# EAGLE design ENGI301_Project-2 (EAGLE 9.5.2)
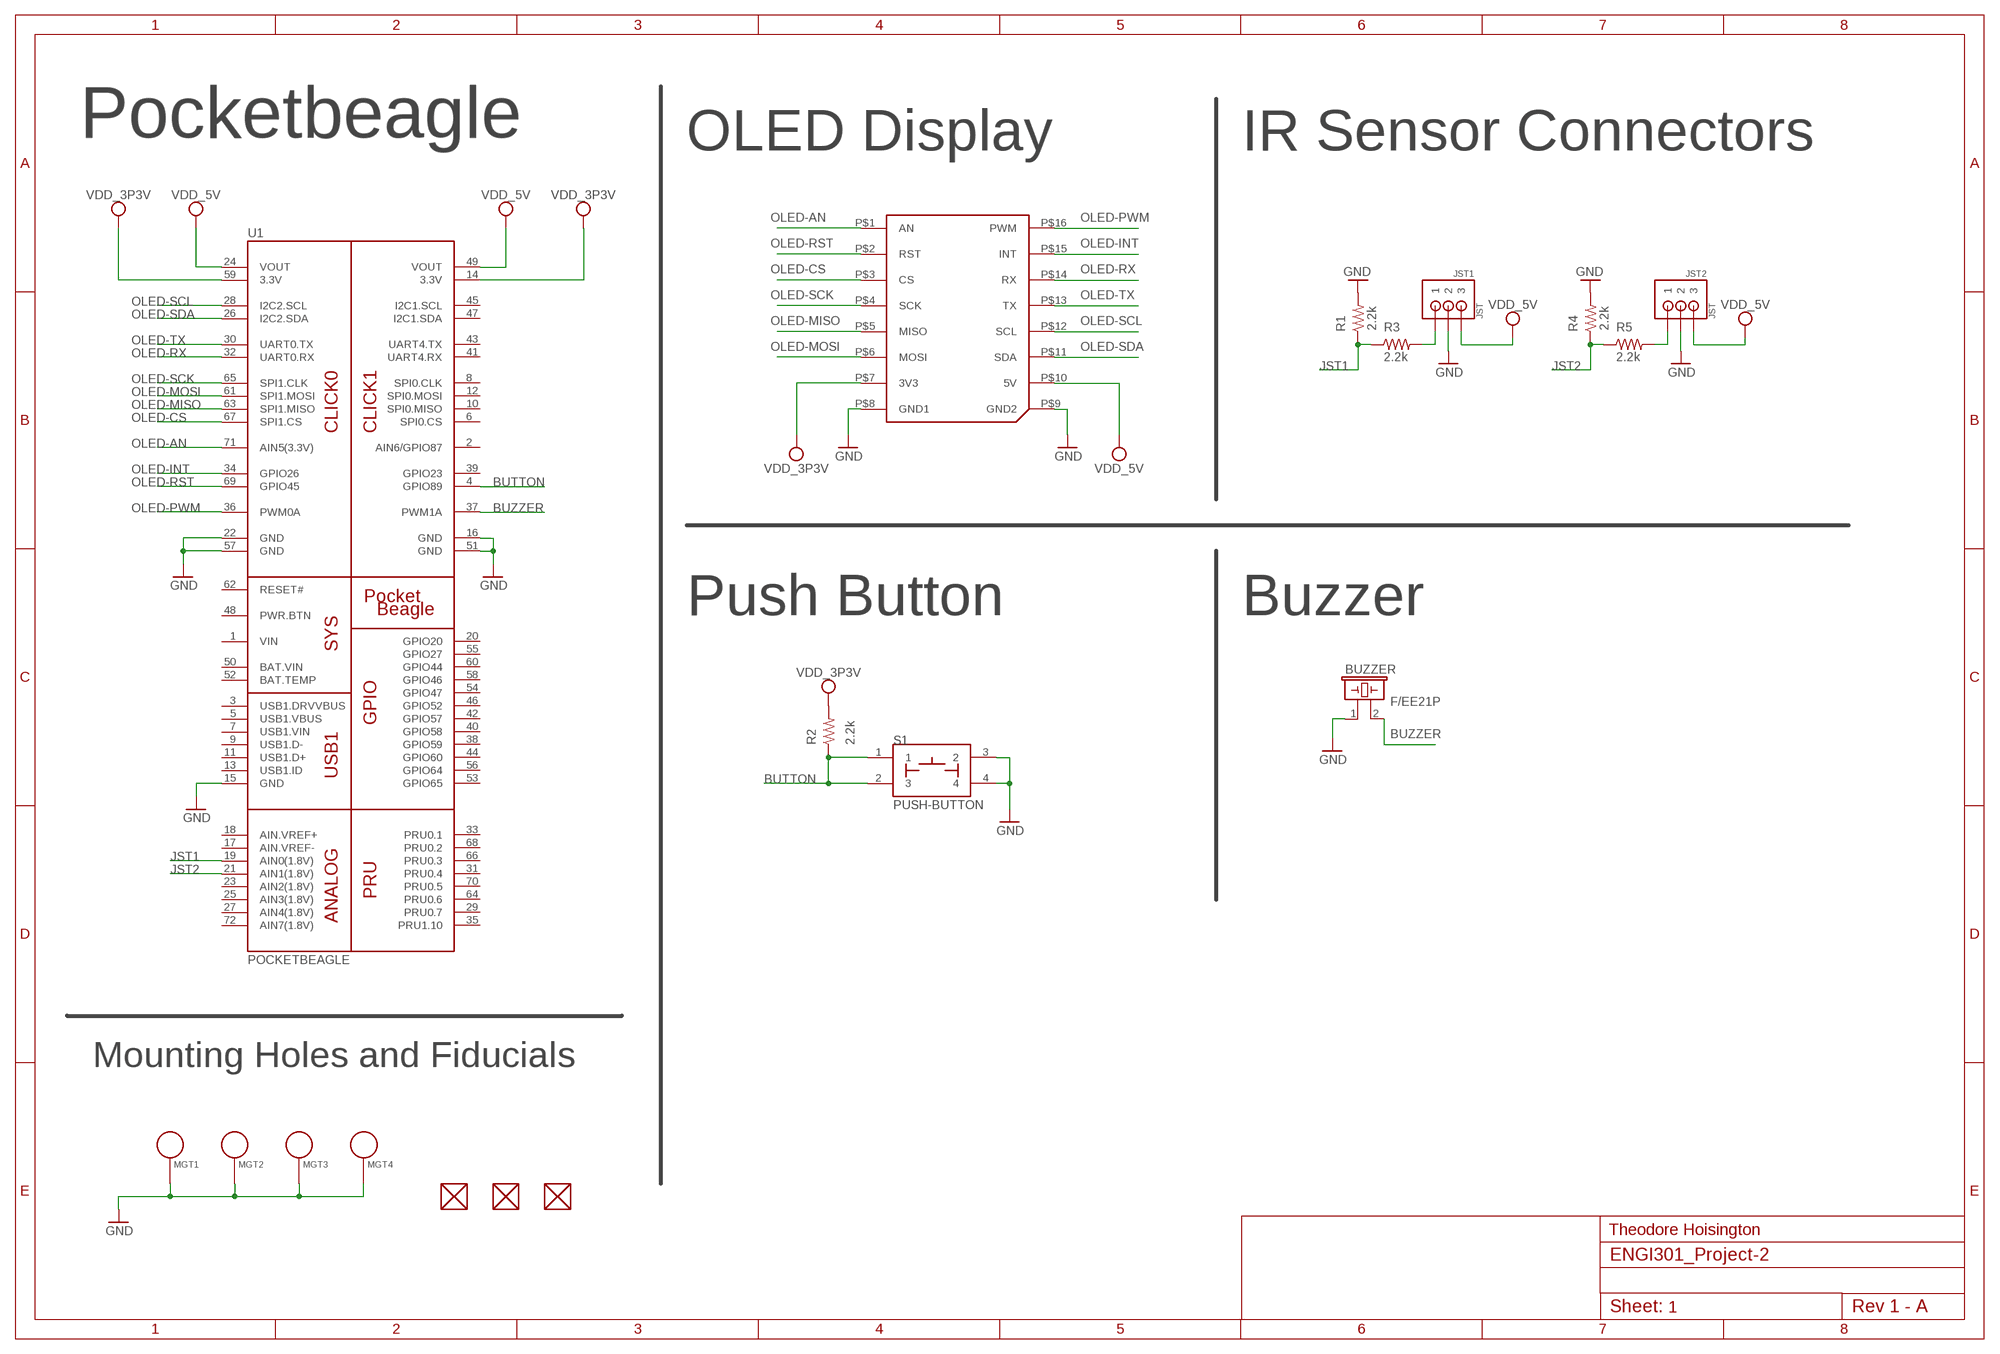
[diagram p0: schematic, sheet 1]

## Parts
BUZZER  F/EE21P  [F/EE21P]
FUD1  FIDUCIAL  [FIDUCIAL_40MIL]
FUD2  FIDUCIAL  [FIDUCIAL_40MIL]
FUD3  FIDUCIAL  [FIDUCIAL_40MIL]
JST1  JST  [JST_HEADER]
JST2  JST  [JST_HEADER]
MGT1  MOUNTING_HOLE  [MOUNTING_HOLE]
MGT2  MOUNTING_HOLE  [MOUNTING_HOLE]
MGT3  MOUNTING_HOLE  [MOUNTING_HOLE]
MGT4  MOUNTING_HOLE  [MOUNTING_HOLE]
R1  2.2k  R_R0603  [R0603]
R2  2.2k  R_R0603  [R0603]
R3  2.2k  R_R0603  [R0603]
R4  2.2k  R_R0603  [R0603]
R5  2.2k  R_R0603  [R0603]
S1  PUSH-BUTTON  [BUTTON_12.5MM]
U1  POCKETBEAGLE  [POCKETBEAGLE]
U2  MIKROE_CLICKLARGE  [MIKROE_BUS_LARGE]

## Nets
BUTTON: R2.1 S1.1 S1.2 U1.4(GPIO89)
BUZZER: BUZZER.2 U1.37(PWM1A)
GND: BUZZER.1 JST1.P2 JST2.P2 MGT1.P$1 MGT2.P$1 MGT3.P$1 MGT4.P$1 R1.2 R4.2 S1.3 S1.4 U1.15(GND) U1.16(GND) U1.22(GND) U1.51(GND) U1.57(GND) U2.P$8(GND1) U2.P$9(GND2)
JST1: R1.1 R3.1 U1.19(AIN0(1.8V))
JST2: R4.1 R5.1 U1.21(AIN1(1.8V))
N$15: JST1.P3 R3.2
N$16: JST2.P3 R5.2
OLED-AN: U1.71(AIN5(3.3V)) U2.P$1(AN)
OLED-CS: U1.67(SPI1.CS) U2.P$3(CS)
OLED-INT: U1.34(GPIO26) U2.P$15(INT)
OLED-MISO: U1.63(SPI1.MISO) U2.P$5(MISO)
OLED-MOSI: U1.61(SPI1.MOSI) U2.P$6(MOSI)
OLED-PWM: U1.36(PWM0A) U2.P$16(PWM)
OLED-RST: U1.69(GPIO45) U2.P$2(RST)
OLED-RX: U1.32(UART0.RX) U2.P$14(RX)
OLED-SCK: U1.65(SPI1.CLK) U2.P$4(SCK)
OLED-SCL: U1.28(I2C2.SCL) U2.P$12(SCL)
OLED-SDA: U1.26(I2C2.SDA) U2.P$11(SDA)
OLED-TX: U1.30(UART0.TX) U2.P$13(TX)
VDD_3P3V: R2.2 U1.14(3.3V) U1.59(3.3V) U2.P$7(3V3)
VDD_5V: JST1.P1 JST2.P1 U1.24(VOUT) U1.49(VOUT) U2.P$10(5V)
Unconnected: FUD1.P$1 FUD2.P$1 FUD3.P$1 U1.2(AIN6/GPIO87) U1.3(USB1.DRVVBUS) U1.5(USB1.VBUS) U1.6(SPI0.CS) U1.7(USB1.VIN) U1.8(SPI0.CLK) U1.9(USB1.D-) U1.10(SPI0.MISO) U1.11(USB1.D+) U1.12(SPI0.MOSI) U1.13(USB1.ID) U1.17(AIN.VREF-) U1.18(AIN.VREF+) U1.20(GPIO20) U1.23(AIN2(1.8V)) U1.25(AIN3(1.8V)) U1.27(AIN4(1.8V)) U1.29(PRU0.7) U1.31(PRU0.4) U1.33(PRU0.1) U1.35(PRU1.10) U1.38(GPIO59) U1.39(GPIO23) U1.40(GPIO58) U1.41(UART4.RX) U1.42(GPIO57) U1.43(UART4.TX) U1.44(GPIO60) U1.45(I2C1.SCL) U1.46(GPIO52) U1.47(I2C1.SDA) U1.48(PWR.BTN) U1.52(BAT.TEMP) U1.53(GPIO65) U1.54(GPIO47) U1.55(GPIO27) U1.56(GPIO64) U1.58(GPIO46) U1.60(GPIO44) U1.62(RESET#) U1.64(PRU0.6) U1.66(PRU0.3) U1.68(PRU0.2) U1.70(PRU0.5) U1.72(AIN7(1.8V))

## Notes on the sheet
- Pocketbeagle | OLED Display | IR Sensor Connectors
- Push Button | Buzzer
- Mounting Holes and Fiducials
- Theodore Hoisington
- 1

## Power pins joined to a net without a drawn wire
BAT.VIN: U1.50(BAT.VIN)
VIN: U1.1(VIN)

## Library data of the parts
BUZZER = project-2:F/EE21P: BUZZER Source: Buerklin; OC_FARNELL: unknown; OC_NEWARK: unknown
FUD1-FUD3 = project-2:FIDUCIAL
JST1 JST2 = ENGI301_Project-2:JST: Male 3-pin JST connector to mount Analog IR sensor
MGT1-MGT4 = project-2:MOUNTING_HOLE: Chassis Mounting Hole w/GND connection ability
R1-R5 = project-2:R_: RESISTOR, American symbol
S1 = project-2:PUSH-BUTTON: Generic Push Button
U1 = project-2:POCKETBEAGLE: Pocketbeagle, Compact Linux board based off of Beaglebone
U2 = project-2:MIKROE_CLICK: Mikroe OLED Click board 96x96 pixel display

## Board
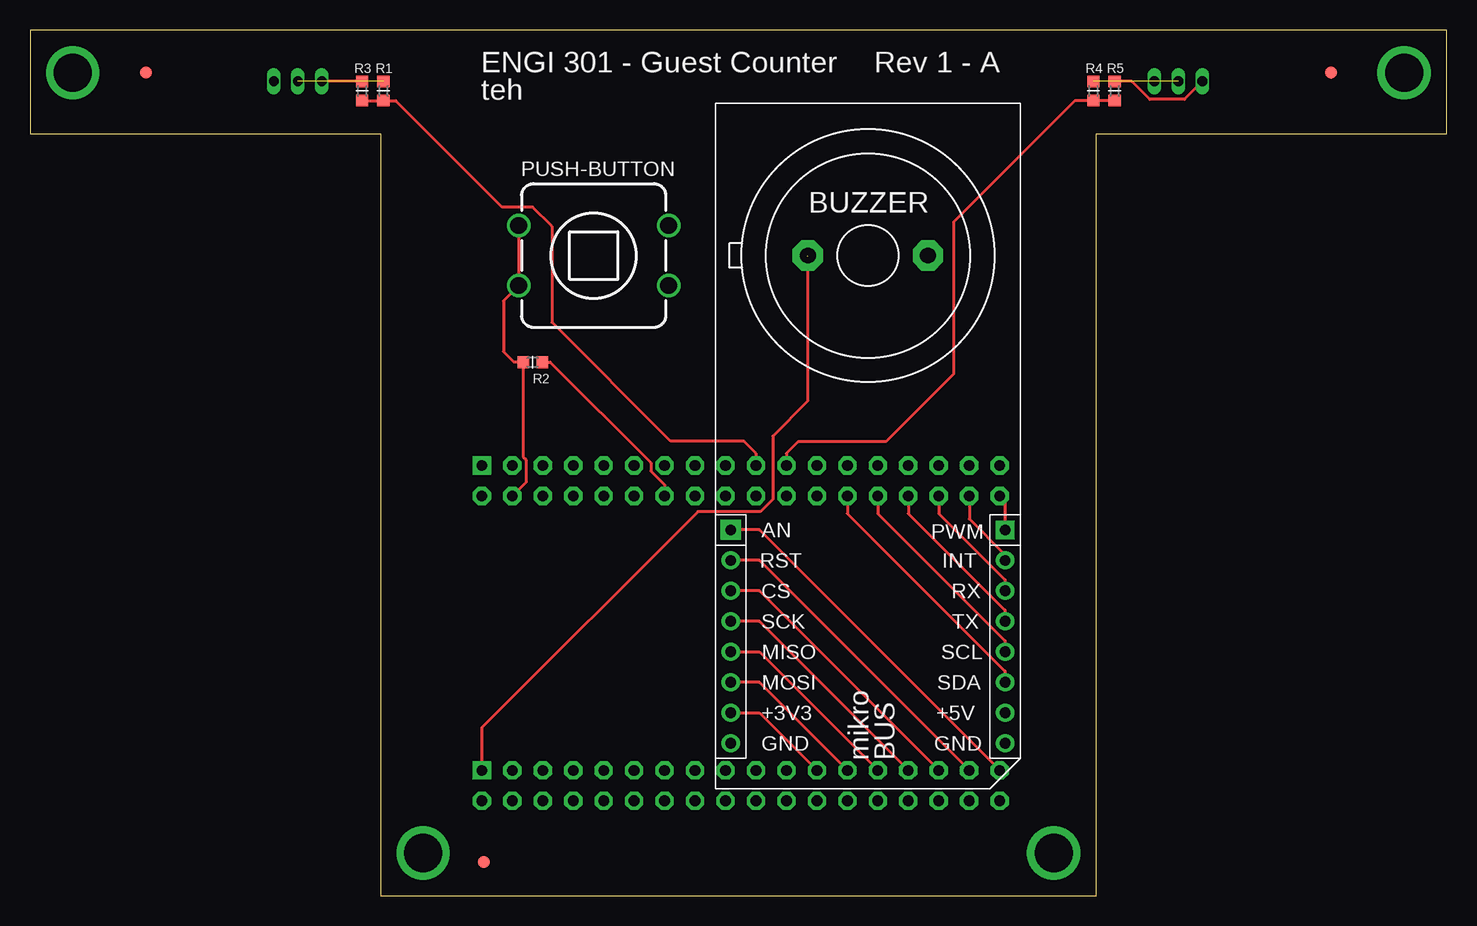
[diagram p1: board, top side]
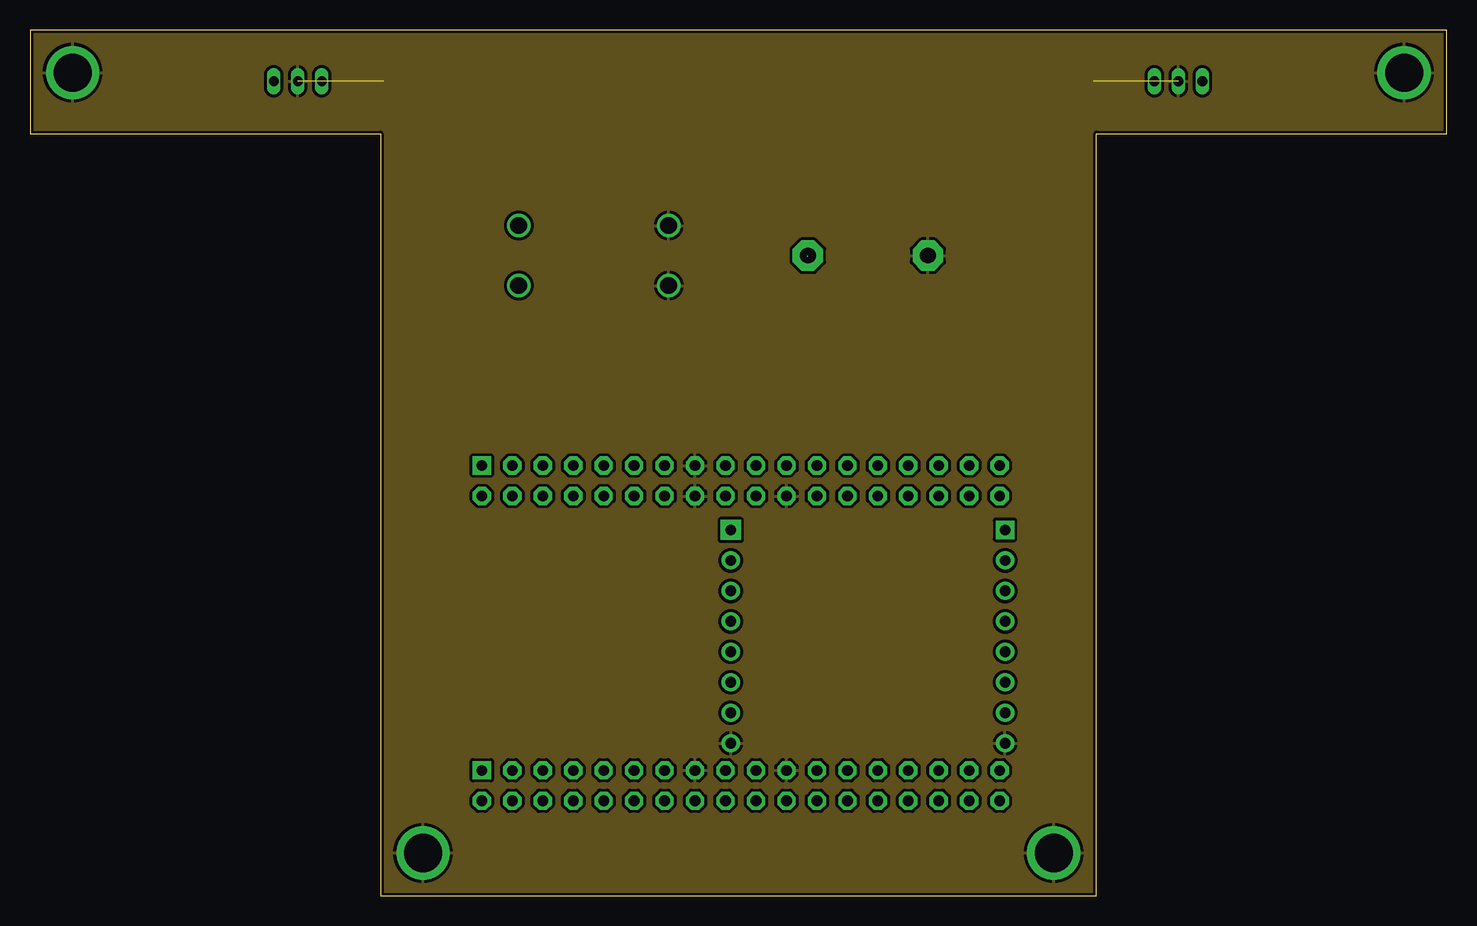
[diagram p2: board, inner layer Route2]
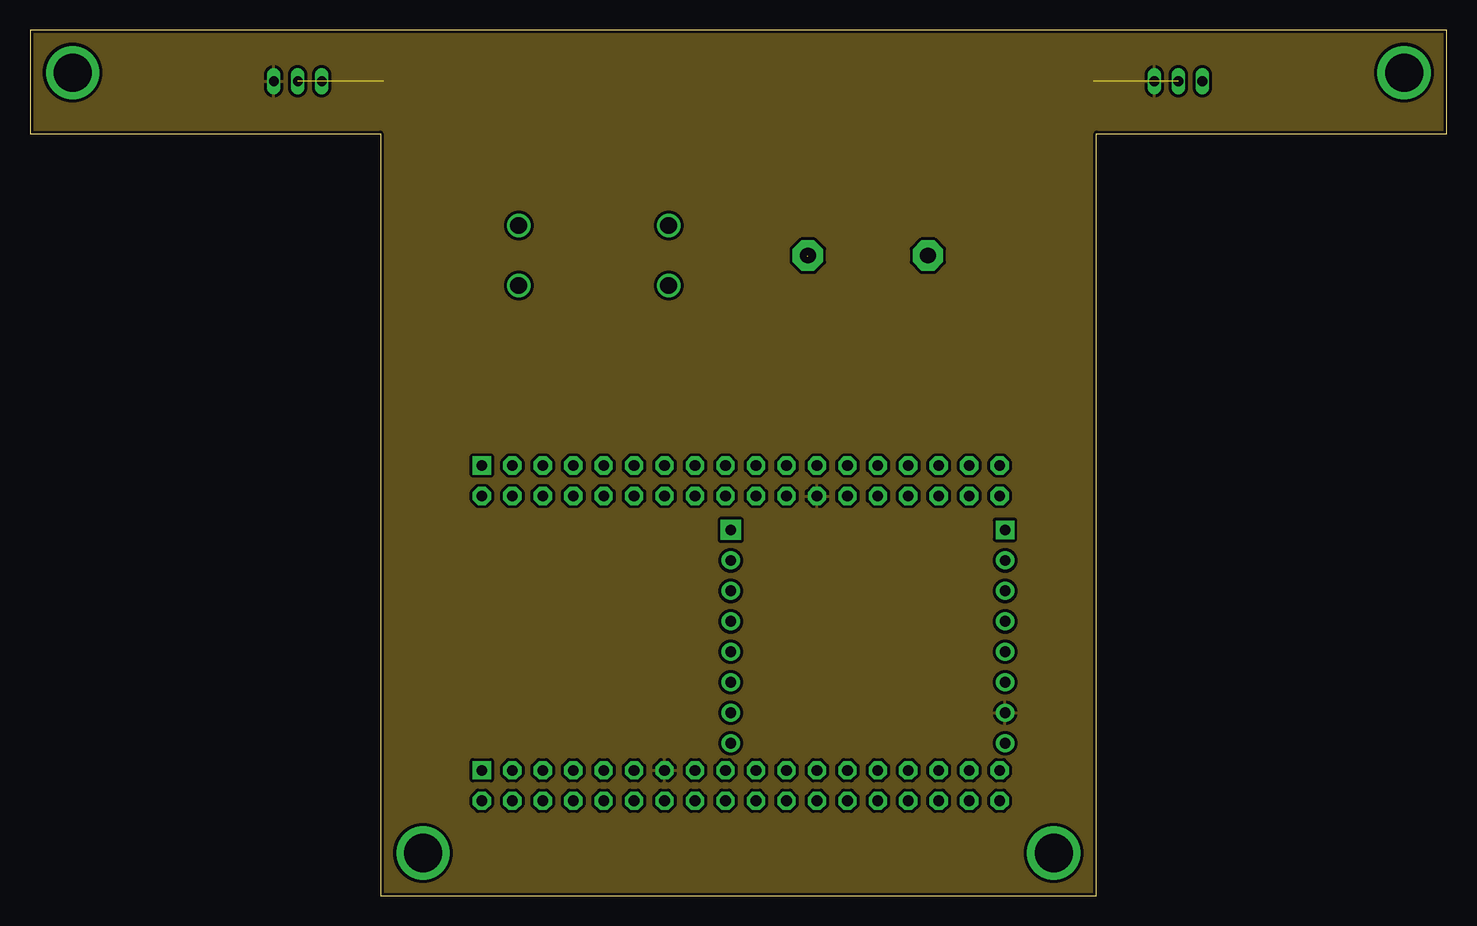
[diagram p3: board, inner layer Route15]
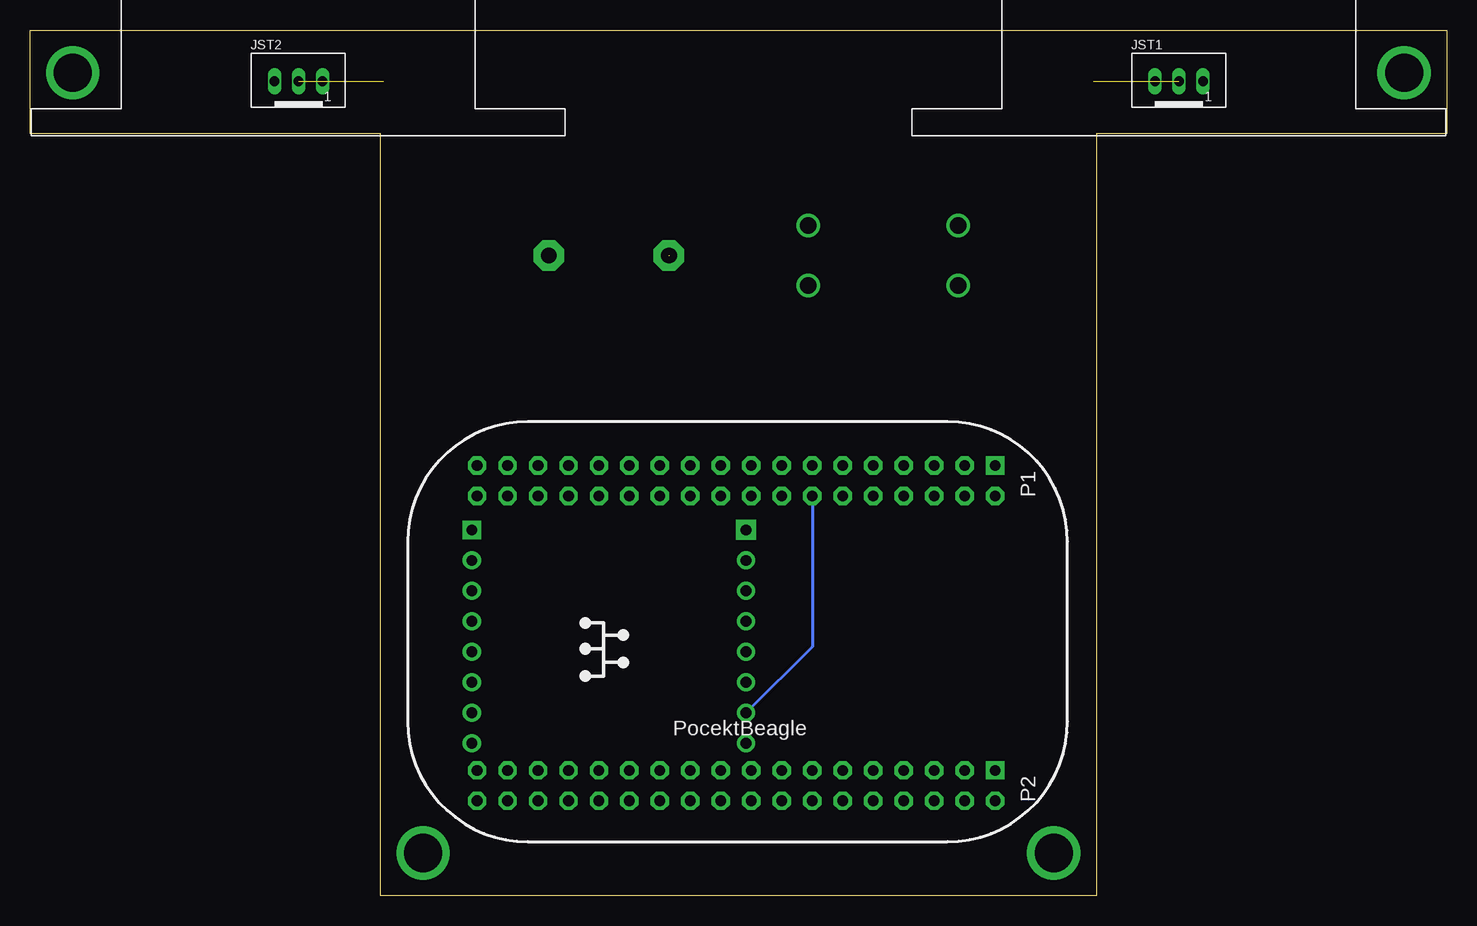
[diagram p4: board, bottom side, seen from below]

Size 118.11 x 72.14 mm. Coordinates in mm from the lower left corner, seen from the top.
Outline: 0,63.5 29.21,63.5 29.21,0 88.9,0 88.9,63.5 118.11,63.5 118.11,72.14 0,72.14 0,63.5
Copper layers (1*2*15*16): Top 0.035mm / dielectric 0.23mm / Route2 0.035mm / dielectric 0.93mm / Route15 0.035mm / dielectric 0.23mm / Bottom 0.035mm
Design rules "ENGI301_4lyr": minimum track width 10mil, minimum drill 12mil, track to track 10mil, track to pad 10mil, pad to pad 10mil, via to via 10mil, smd to smd 10mil, copper to edge 10mil, drill to drill 12mil, minimum pad ring 6mil, minimum via ring 6mil, stop-mask expansion 3mil, vias tented up to drill 25mil, thermal gap 10mil

### Footprints (pad centres in the part's own frame; a part is rotated, then mirrored left to right if it is on the bottom)
F/EE21P = drill 1.321 pad 2.54 octagon: 1 -5.004,0; 2 5.004,0
FIDUCIAL_40MIL = smd 1.016 x 1.016: P$1 0,0
JST_HEADER = drill 0.8 long: P1 2.027,0.048; P2 0.028,0.048; P3 -1.972,0.048
MOUNTING_HOLE = drill 3.175 pad 4.445: P$1 0,0
R0603 = smd 0.95 x 1.031: 1 -0.8,0; 2 0.8,0
BUTTON_12.5MM = drill 1.4: 1 -6.25,2.5; 2 -6.25,-2.5; 3 6.25,2.5; 4 6.25,-2.5
POCKETBEAGLE = drill 0.889 pad 1.524 square: 1 5.91,3.53; 37 5.91,28.93 | drill 0.889 pad 1.524 octagon: 2 5.91,6.07; 3 8.45,3.53; 4 8.45,6.07; 5 10.99,3.53; 6 10.99,6.07; 7 13.53,3.53; 8 13.53,6.07; 9 16.07,3.53; 10 16.07,6.07; 11 18.61,3.53; 12 18.61,6.07; 13 21.15,3.53; 14 21.15,6.07; 15 23.69,3.53; 16 23.69,6.07; 17 26.23,3.53; 18 26.23,6.07; 19 28.77,3.53; 20 28.77,6.07; 21 31.31,3.53; 22 31.31,6.07; 23 33.85,3.53; 24 33.85,6.07; 25 36.39,3.53; 26 36.39,6.07; 27 38.93,3.53; 28 38.93,6.07; 29 41.47,3.53; 30 41.47,6.07; 31 44.01,3.53; 32 44.01,6.07; 33 46.55,3.53; 34 46.55,6.07; 35 49.09,3.53; 36 49.09,6.07; 38 5.91,31.47; 39 8.45,28.93; 40 8.45,31.47; 41 10.99,28.93; 42 10.99,31.47; 43 13.53,28.93; 44 13.53,31.47; 45 16.07,28.93; 46 16.07,31.47; 47 18.61,28.93; 48 18.61,31.47; 49 21.15,28.93; 50 21.15,31.47; 51 23.69,28.93; 52 23.69,31.47; 53 26.23,28.93; 54 26.23,31.47; 55 28.77,28.93; 56 28.77,31.47; 57 31.31,28.93; 58 31.31,31.47; 59 33.85,28.93; 60 33.85,31.47; 61 36.39,28.93; 62 36.39,31.47; 63 38.93,28.93; 64 38.93,31.47; 65 41.47,28.93; 66 41.47,31.47; 67 44.01,28.93; 68 44.01,31.47; 69 46.55,28.93; 70 46.55,31.47; 71 49.09,28.93; 72 49.09,31.47
MIKROE_BUS_LARGE = drill 0.889 pad 1.676 square: P$1 1.27,21.59 | drill 0.889 pad 1.524: P$2 1.27,19.05; P$3 1.27,16.51; P$4 1.27,13.97; P$5 1.27,11.43; P$6 1.27,8.89; P$7 1.27,6.35; P$8 1.27,3.81; P$9 24.13,3.81; P$10 24.13,6.35; P$11 24.13,8.89; P$12 24.13,11.43; P$13 24.13,13.97; P$14 24.13,16.51; P$15 24.13,19.05 | drill 0.889 pad 1.524 square: P$16 24.13,21.59

### Placement (x,y rotation side)
BUZZER  69.85,53.34 180 top
FUD1  9.65,68.58 0 top
FUD2  108.46,68.58 0 top
FUD3  37.85,2.79 0 top
JST1  22.35,67.82 0 bottom
JST2  95.76,67.82 0 bottom
MGT1  32.77,3.56 0 top
MGT2  3.56,68.58 0 top
MGT3  114.55,68.58 0 top
MGT4  85.34,3.56 0 top
R1  29.46,67.06 90 top
R2  41.91,44.45 0 top
R3  27.69,67.06 90 top
R4  88.65,67.06 90 top
R5  90.42,67.06 90 top
S1  46.99,53.34 0 top
U1  31.75,39.37 180 bottom
U2  57.15,8.89 0 top

### Tracks (layer width: path | path; a pad name or v marks a point on that pad's centre or on a via)
BUTTON
  Top 0.254: R2.1 40.35,44.45 39.47,45.33 39.47,49.57 S1.2 S1.1 | R2.1 41.11,44.24 | R2.1 41.11,36.55 41.34,36.31 41.34,34.44 U1.4
BUZZER  (1 unrouted)
  Top 0.254: U1.37 37.66,14 55.67,32 60.89,32 61.92,33.03 61.92,38.3 64.81,41.19 64.81,53.3
GND  (2 unrouted)
  pour Route2: -2.54,81.28 -2.54,-2.54 121.92,-2.54 121.92,81.28
JST1
  Top 0.254: R3.1 R1.1 30.48,66.26 39.37,57.37 41.9,57.37 43.5,55.77 43.5,47.78 53.41,37.87 59.5,37.87 60.52,36.86 U1.19
JST2
  Top 0.254: R5.1 R4.1 87.12,66.26 77.01,56.15 77.01,43.48 71.39,37.86 64.06,37.86 63.06,36.87 U1.21
N$15
  Top 0.254: R3.2 24.33,67.86 JST1.P3
N$16
  Top 0.254: R5.2 91.85,67.86 93.34,66.36 96.23,66.36 JST2.P3
OLED-AN
  Top 0.254: U1.71 60.8,30.48 U2.P$1
OLED-CS
  Top 0.254: U1.67 60.8,25.4 U2.P$3
OLED-INT
  Top 0.254: U1.34 78.3,31.4 81.28,28.42 U2.P$15
OLED-MISO
  Top 0.254: U2.P$5 60.8,20.32 U1.63
OLED-MOSI
  Top 0.254: U1.61 60.8,17.78 U2.P$6
OLED-PWM
  Top 0.254: U1.36 81.28,32.86 U2.P$16
OLED-RST
  Top 0.254: U1.69 60.8,27.94 U2.P$2
OLED-RX
  Top 0.254: U1.32 75.76,31.84 81.28,26.32 U2.P$14
OLED-SCK
  Top 0.254: U1.65 60.8,22.86 U2.P$4
OLED-SCL
  Top 0.254: U1.28 70.68,31.84 81.28,21.24 U2.P$12
OLED-SDA
  Top 0.254: U1.26 68.14,31.84 81.28,18.7 U2.P$11
OLED-TX
  Top 0.254: U1.30 73.22,31.84 81.28,23.78 U2.P$13
VDD_3P3V
  Top 0.254: U2.P$7 60.8,15.24 U1.59 | R2.2 43.37,44.45 51.76,36.06 51.76,35.37 52.9,34.22 U1.14
  Bottom 0.254: U1.14 52.9,20.76 U2.P$7
VDD_5V
  pour Route15: -2.54,81.93 124.46,81.93 124.46,-2.54 -2.54,-2.54

### Text on the board
tPlace: ENGI 301 - Guest Counter | Rev 1 - A | teh